# EAGLE design untitled (EAGLE 9.6.2)
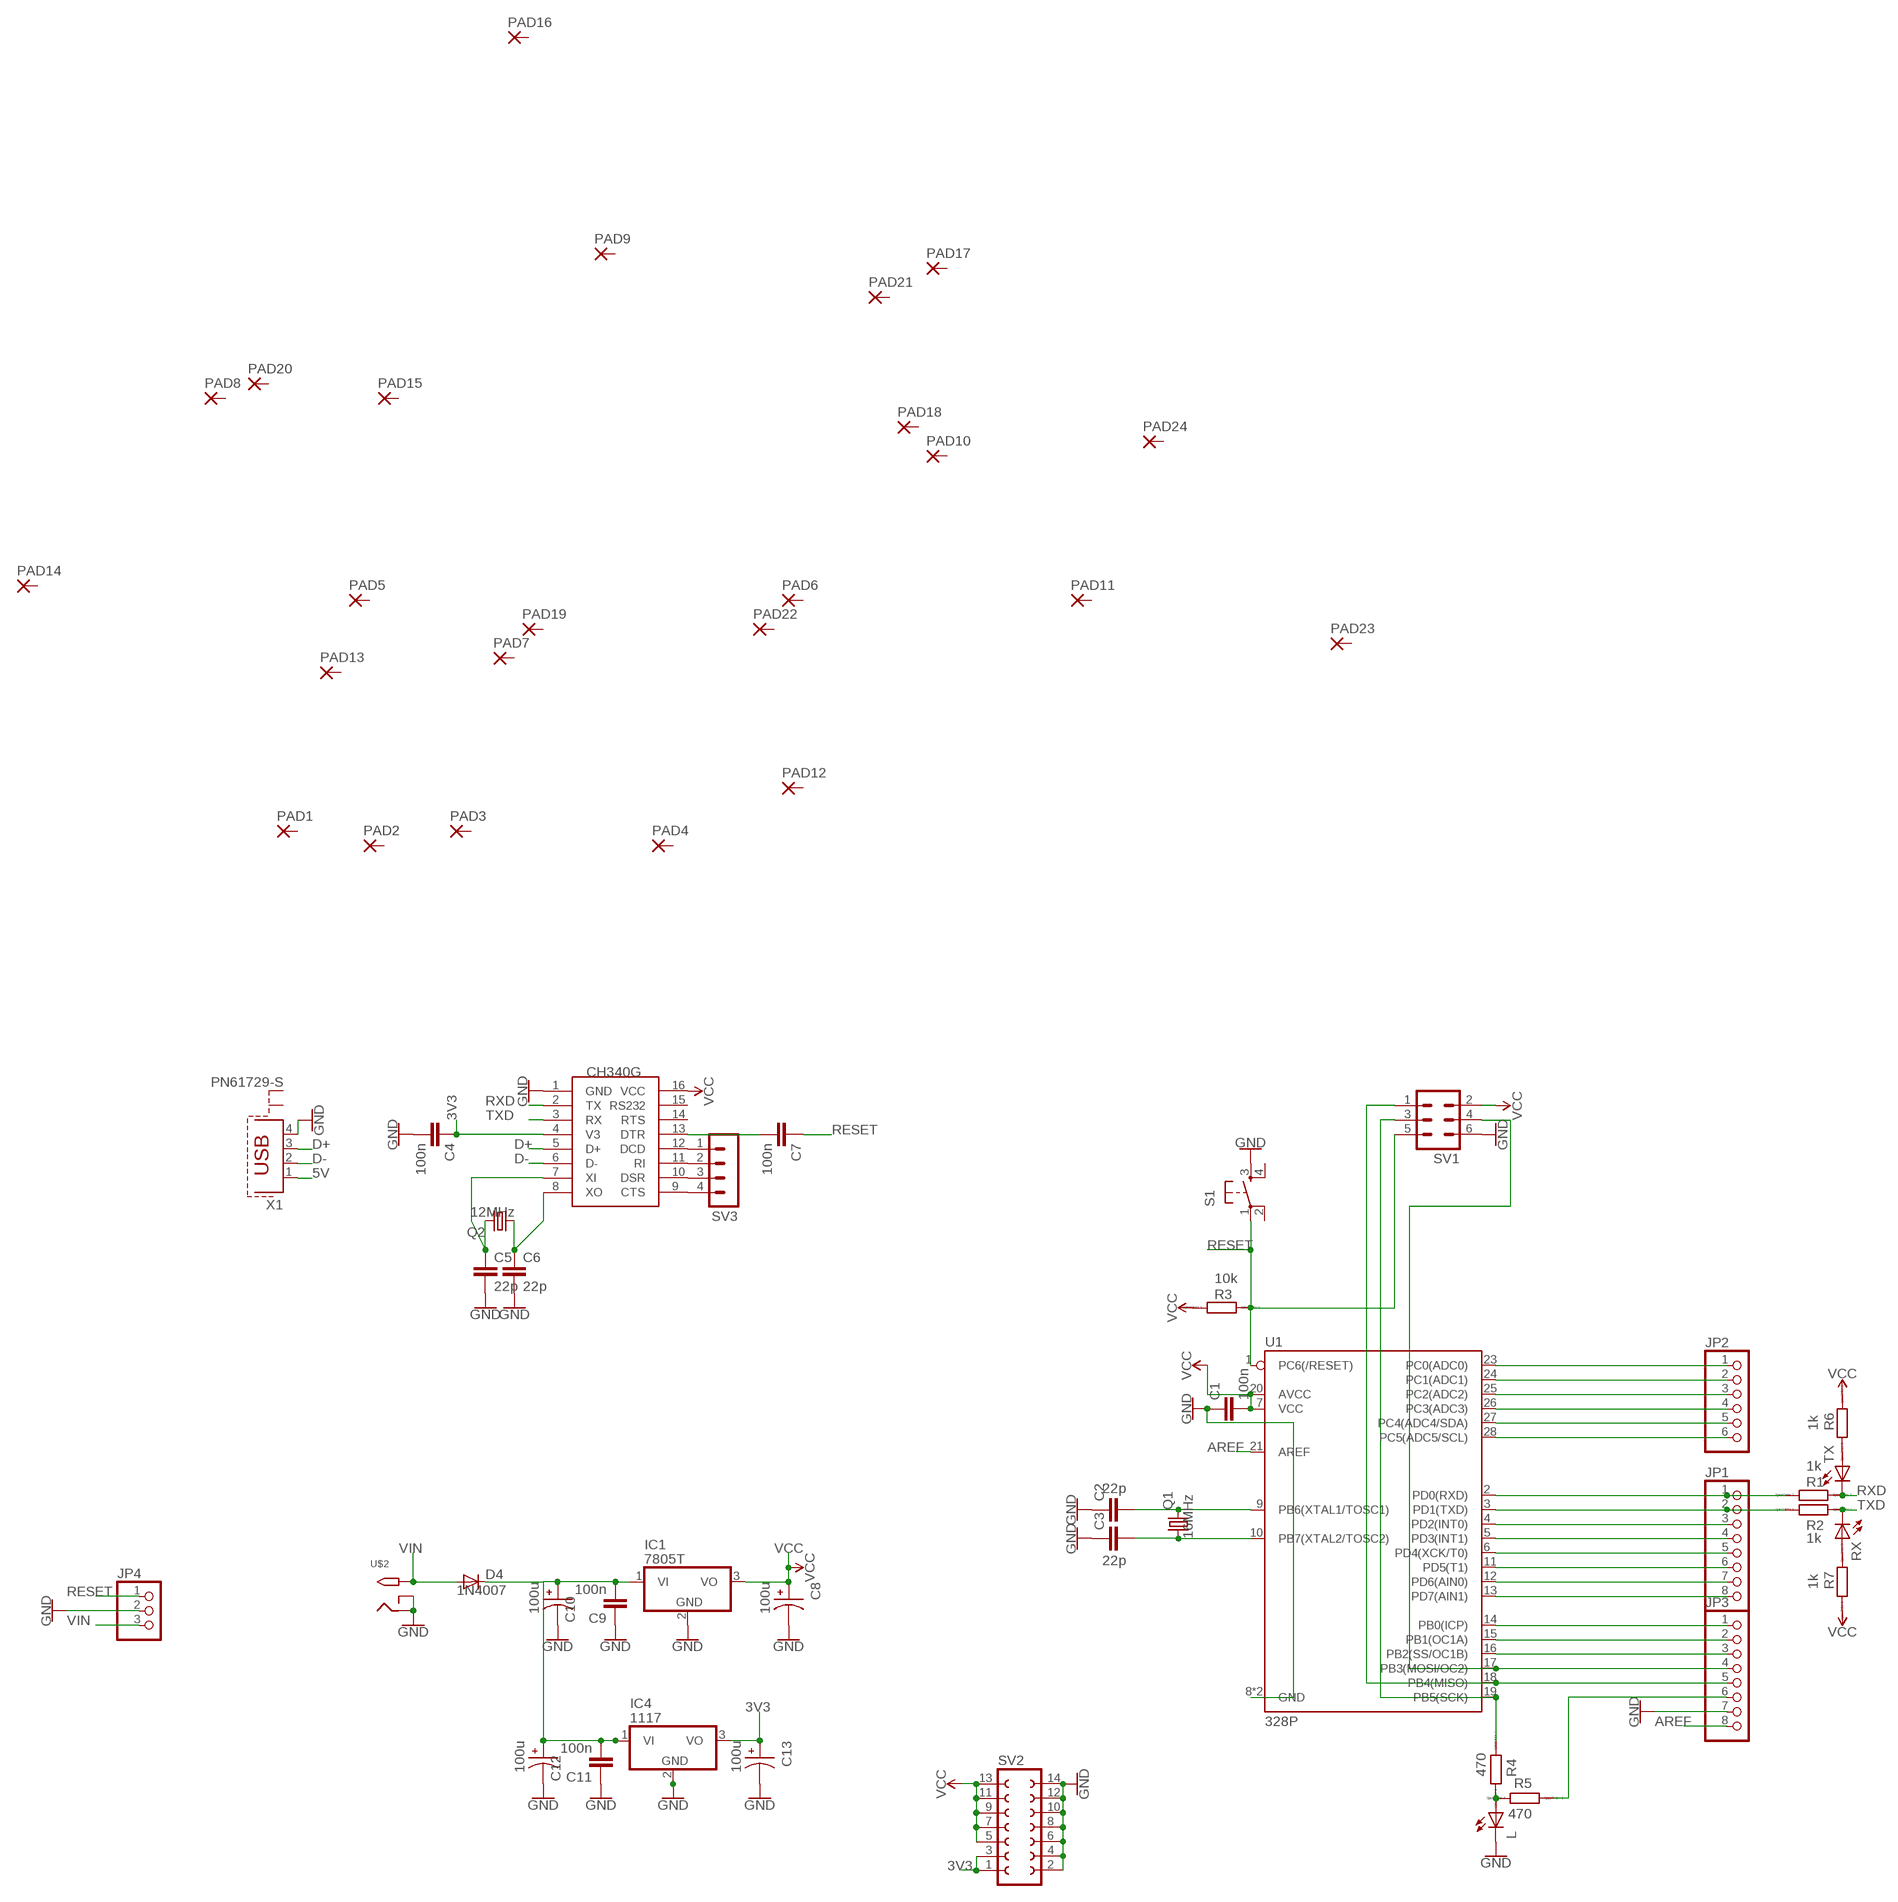
[diagram p0: schematic, sheet 1]

## Parts
C1  100n  C2,5-3  [C2.5-3]
C2  22p  C2,5-3  [C2.5-3]
C3  22p  C2,5-3  [C2.5-3]
C4  100n  C2,5-3  [C2.5-3]
C5  22p  C2,5-3  [C2.5-3]
C6  22p  C2,5-3  [C2.5-3]
C7  100n  C2,5-3  [C2.5-3]
C8  100u  ECA1VHG100B  [CAPPRD500W50D500H1100]
C9  100n  C2,5-3  [C2.5-3]
C10  100u  ECA1VHG100B  [CAPPRD500W50D500H1100]
C11  100n  C2,5-3  [C2.5-3]
C12  100u  ECA1VHG100B  [CAPPRD500W50D500H1100]
C13  100u  ECA1VHG100B  [CAPPRD500W50D500H1100]
D4  1N4007  1N4004  [DO41-10]
IC1  7805T  [TO220H]
IC4  1117  7805T  [TO220H]
JP1  PINHD-1X8CLEANBIG  [1X08-CLEANBIG]
JP2  PINHD-1X6  [1X06]
JP3  PINHD-1X8CLEANBIG  [1X08-CLEANBIG]
JP4  PINHD-1X3  [1X03]
L  LED3MM  [LED3MM]
PAD1  SMD5  [SMD2,54-5,08]
PAD2  SMD5  [SMD2,54-5,08]
PAD3  SMD5  [SMD2,54-5,08]
PAD4  SMD5  [SMD2,54-5,08]
PAD5  SMD5  [SMD2,54-5,08]
PAD6  SMD5  [SMD2,54-5,08]
PAD7  SMD5  [SMD2,54-5,08]
PAD8  SMD5  [SMD2,54-5,08]
PAD9  SMD5  [SMD2,54-5,08]
PAD10  SMD5  [SMD2,54-5,08]
PAD11  SMD5  [SMD2,54-5,08]
PAD12  SMD5  [SMD2,54-5,08]
PAD13  SMD5  [SMD2,54-5,08]
PAD14  SMD5  [SMD2,54-5,08]
PAD15  SMD5  [SMD2,54-5,08]
PAD16  SMD5  [SMD2,54-5,08]
PAD17  SMD5  [SMD2,54-5,08]
PAD18  SMD5  [SMD2,54-5,08]
PAD19  SMD5  [SMD2,54-5,08]
PAD20  SMD5  [SMD2,54-5,08]
PAD21  SMD5  [SMD2,54-5,08]
PAD22  SMD5  [SMD2,54-5,08]
PAD23  SMD5  [SMD2,54-5,08]
PAD24  SMD5  [SMD2,54-5,08]
Q1  16MHz  CRYSTALHC49S  [HC49/S]
Q2  12MHz  CRYSTALHC49S  [HC49/S]
R1  1k  R0204/7  [0204/7]
R2  1k  R0204/7  [0204/7]
R3  10k  R0204/7  [0204/7]
R4  470  R0204/7  [0204/7]
R5  470  R0204/7  [0204/7]
R6  1k  R0204/7  [0204/7]
R7  1k  R0204/7  [0204/7]
RX  LED3MM  [LED3MM]
S1  TAC_SWITCHPTH  [TACTILE-PTH]
SV1  MA03-2  [MA03-2]
SV2  FE07-2  [FE07-2]
SV3  MA04-1  [MA04-1]
TX  LED3MM  [LED3MM]
U1  328P  ATMEGA328P_PDIP  [DIP28]
U$1  CH340G  [SOIC16]
U$2  2.1MMJACKTHM  [PJ-102A]
X1  PN61729-S  [PN61729-S]

## Nets
3V3: C4.1 C13.P IC4.3(VO) SV2.1 SV2.3 U$1.4(V3)
5V: X1.1
AREF: JP3.8 U1.21(AREF)
D+: U$1.5(D+) X1.3
D-: U$1.6(D-) X1.2
GND: C1.1 C2.1 C3.1 C4.2 C5.2 C6.2 C8.N C9.1 C10.N C11.1 C12.N C13.N IC1.2(GND) IC4.2(GND) JP3.7 JP4.2 L.K(C) S1.3 SV1.6 SV2.2 SV2.4 SV2.6 SV2.8 SV2.10 SV2.12 SV2.14 U1.8(GND) U1.22(GND) U$1.1(GND) U$2.RING U$2.RING_SW X1.4
N$1: JP1.1 R1.1 U1.2(PD0(RXD))
N$2: JP1.2 R2.1 U1.3(PD1(TXD))
N$3: JP1.3 U1.4(PD2(INT0))
N$4: JP1.4 U1.5(PD3(INT1))
N$5: JP1.5 U1.6(PD4(XCK/T0))
N$6: JP1.6 U1.11(PD5(T1))
N$7: JP1.7 U1.12(PD6(AIN0))
N$8: JP1.8 U1.13(PD7(AIN1))
N$9: JP2.1 U1.23(PC0(ADC0))
N$10: JP2.2 U1.24(PC1(ADC1))
N$11: JP2.3 U1.25(PC2(ADC2))
N$12: JP2.4 U1.26(PC3(ADC3))
N$13: JP2.5 U1.27(PC4(ADC4/SDA))
N$14: JP2.6 U1.28(PC5(ADC5/SCL))
N$15: JP3.1 U1.14(PB0(ICP))
N$16: JP3.2 U1.15(PB1(OC1A))
N$17: JP3.3 U1.16(PB2(SS/OC1B))
N$18: JP3.4 SV1.4 U1.17(PB3(MOSI/OC2))
N$19: JP3.5 SV1.1 U1.18(PB4(MISO))
N$20: R4.2 SV1.3 U1.19(PB5(SCK))
N$21: C2.2 Q1.2 U1.9(PB6(XTAL1/TOSC1))
N$22: C3.2 Q1.1 U1.10(PB7(XTAL2/TOSC2))
N$23: SV3.1 U$1.12(DCD)
N$24: JP3.6 R5.1
N$25: C5.1 Q2.2 U$1.7(XI)
N$26: C6.1 Q2.1 U$1.8(XO)
N$27: L.A R4.1 R5.2
N$28: SV3.2 U$1.11(RI)
N$29: SV3.3 U$1.10(DSR)
N$30: SV3.4 U$1.9(CTS)
N$31: C7.2 U$1.13(DTR)
N$32: R6.1 TX.A
N$33: C9.2 C10.P C11.2 C12.P D4.C IC1.1(VI) IC4.1(VI)
N$34: R7.2 RX.A
RESET: C7.1 JP4.1 R3.2 S1.1 SV1.5 U1.1(PC6(/RESET))
RXD: R1.2 TX.K(C) U$1.2(TX)
TXD: R2.2 RX.K(C) U$1.3(RX)
VCC: C1.2 C8.P IC1.3(VO) R3.1 R6.2 R7.1 SV1.2 SV2.5 SV2.7 SV2.9 SV2.11 SV2.13 U1.7(VCC) U1.20(AVCC) U$1.16(VCC)
VIN: D4.A JP4.3 U$2.TIP
Unconnected: PAD1.1(P) PAD2.1(P) PAD3.1(P) PAD4.1(P) PAD5.1(P) PAD6.1(P) PAD7.1(P) PAD8.1(P) PAD9.1(P) PAD10.1(P) PAD11.1(P) PAD12.1(P) PAD13.1(P) PAD14.1(P) PAD15.1(P) PAD16.1(P) PAD17.1(P) PAD18.1(P) PAD19.1(P) PAD20.1(P) PAD21.1(P) PAD22.1(P) PAD23.1(P) PAD24.1(P) S1.2 S1.4 U$1.14(RTS) U$1.15(RS232) X1.S1 X1.S2

## Library data of the parts
C1-C7 C9 C11 = capacitor-wima:C: CAPACITOR naming: grid - package width
C8 C10 C12 C13 = ECA1VHG100B:ECA1VHG100B: NHG-A Check prices <https://pricing.snapeda.com/parts/ECA1VHG100B/Panasonic/view-part?ref=eda>; AVAILABILITY: In Stock; DESCRIPTION: Aluminum Electrolytic Capacitors; MF: Panasonic; MP: ECA1VHG100B; PACKAGE: RADIAL-2 Panasonic; PRICE: None
D4 = adafruit:1N4004: DIODE General purpose 1N400x type rectifier (With bigger pads) http://www.ladyada.net/library/pcb/eaglelibrary.html
IC1 IC4 = linear:78*: Positive VOLTAGE REGULATOR Source: http://cache.national.com/ds/LM/LM78L05.pdf http://www.fairchildsemi.com/ds/LM/LM7805.pdf
JP1 JP3 = adafruit:PINHD-1X8: PIN HEADER
JP2 = adafruit:PINHD-1X6: PIN HEADER
JP4 = adafruit:PINHD-1X3: PIN HEADER
L RX TX = adafruit:LED: LED OSRAM: - CHIPLED LG R971, LG N971, LY N971, LG Q971, LY Q971, LO R971, LY R971 LH N974, LH R974 LS Q976, LO Q976, LY Q976 LO Q996 - Hyper CHIPLED LW Q18S LB Q993, LB Q99A, LB R99A - SideLED LS A670, LO A670, LY A670, LG A670, LP A670 LB A673, LV A673, LT A673, LW A673 LH A674 LY A675 LS A676, LA A676, LO A676, LY A676, LW A676 LS A679, LY A679, LG A679 - Hyper Micro SIDELED® LS Y876, LA Y876, LO Y876, LY Y876 LT Y87S - SmartLED LW L88C, LW L88S LB L89C, LB L89S, LG L890 LS L89K, LO L89K, LY L89K LS L896, LA L896, LO L896, LY L896 - TOPLED LS T670, LO T670, LY T670, LG T670, LP T670 LSG T670, LSP T670, LSY T670, LOP T670, LYG T670 LG T671, LOG T671, LSG T671 LB T673, LV T673, LT T673, LW T673 LH T674 LS T676, LA T676, LO T676, LY T676, LB T676, LH T676, LSB T676, LW T676 LB T67C, LV T67C, LT T67C, LS T67K, LO T67K, LY T67K, LW E67C LS E67B, LA E67B, LO E67B, LY E67B, LB E67C, LV E67C, LT E67C LW T67C LS T679, LY T679, LG T679 LS T770, LO T770, LY T770, LG T770, LP T770 LB T773, LV T773, LT T773, LW T773 LH T774 LS E675, LA E675, LY E675, LS T675 LS T776, LA T776, LO T776, LY T776, LB T776 LHGB T686 LT T68C, LB T68C - Hyper Mini TOPLED® LB M676 - Mini TOPLED Santana® LG M470 LS M47K, LO M47K, LY M47K Source: http://www.osram.convergy.de/
PAD1-PAD24 = wirepad:SMD5: SMD PAD
Q1 Q2 = crystal:CRYSTAL: CRYSTAL; OC_FARNELL: 1667008; OC_NEWARK: unknown
R1-R7 = eagle-ltspice:R: RESISTOR, European symbol; SPICEMODEL: NONE; SPICEPREFIX: R
S1 = SparkFun-Retired:TAC_SWITCH: Momentary Switch Button commonly used for reset or general input. Spark Fun Electronics SKU : COM-00097 SMT- SWCH-08247
SV1 = con-lstb:MA03-2: PIN HEADER; OC_FARNELL: unknown; OC_NEWARK: unknown
SV2 = con-lsta:FE07-2: FEMALE HEADER; OC_FARNELL: unknown; OC_NEWARK: unknown
SV3 = con-lstb:MA04-1: PIN HEADER; OC_FARNELL: unknown; OC_NEWARK: unknown
U1 = SparkFun-IC-Microcontroller:ATMEGA328P_PDIP: Atmel 328P Through hole ATMEGA328P uC used in the Arduino 32kb flash, 1k EEPROM, 2k SRAM Datasheet <http://www.sparkfun.com/datasheets/Components/SMD/ATMega328.pdf> SparkFun Products Storefront component: AVR 28 Pin 20MHz 32K 6A/D - ATMega328P <https://www.sparkfun.com/products/9061> (COM-09061) SparkFun Simon Says - Through-Hole Soldering Kit <https://www.sparkfun.com/products/10547> (KIT-10547) SparkFun Learn to Solder - Simon Says <https://www.sparkfun.com/products/13708> (KIT-13708) SparkFun BigTime Watch Kit <https://www.sparkfun.com/products/11734> (KIT-11734) SparkFun ClockIt <https://www.sparkfun.com/products/10930> (KIT-10930) SparkFun Serial Enabled LCD Kit <https://www.sparkfun.com/products/10097> (LCD-10097) SparkFun Simon Tilts - Through Hole Soldering Kit <https://www.sparkfun.com/products/12634> (KIT-12634) SparkFun Frequency Counter Kit <https://www.sparkfun.com/products/10140> (KIT-10140) FabFM Radio Kit <https://www.sparkfun.com/products/11043> (KIT-11043) SparkFun Binary Blaster Kit <https://www.sparkfun.com/products/12037> (KIT-12037) SparkFun Metro-Gnome <https://www.sparkfun.com/products/9236> (KIT-09236) ATmega328 with Arduino Optiboot (Uno) <https://www.sparkfun.com/products/10524> (DEV-10524); PROD_ID: IC-09136
U$1 = ch340g:CH340G
U$2 = adafruit:2.1MMJACK: 2.1mm x 5.5mm THM DC jack with internal switch. Digikey part #PJ-102A, 4UCON part #05537 2.1mm x 5.5mm SMT DC jack with internal switch. Digikey part #PJ-002A-SMT, 4UCON part #03267 By microbuilder.eu & adafruit.com
X1 = con-berg:PN61729-S: BERG USB connector; OC_FARNELL: unknown; OC_NEWARK: unknown

## Board
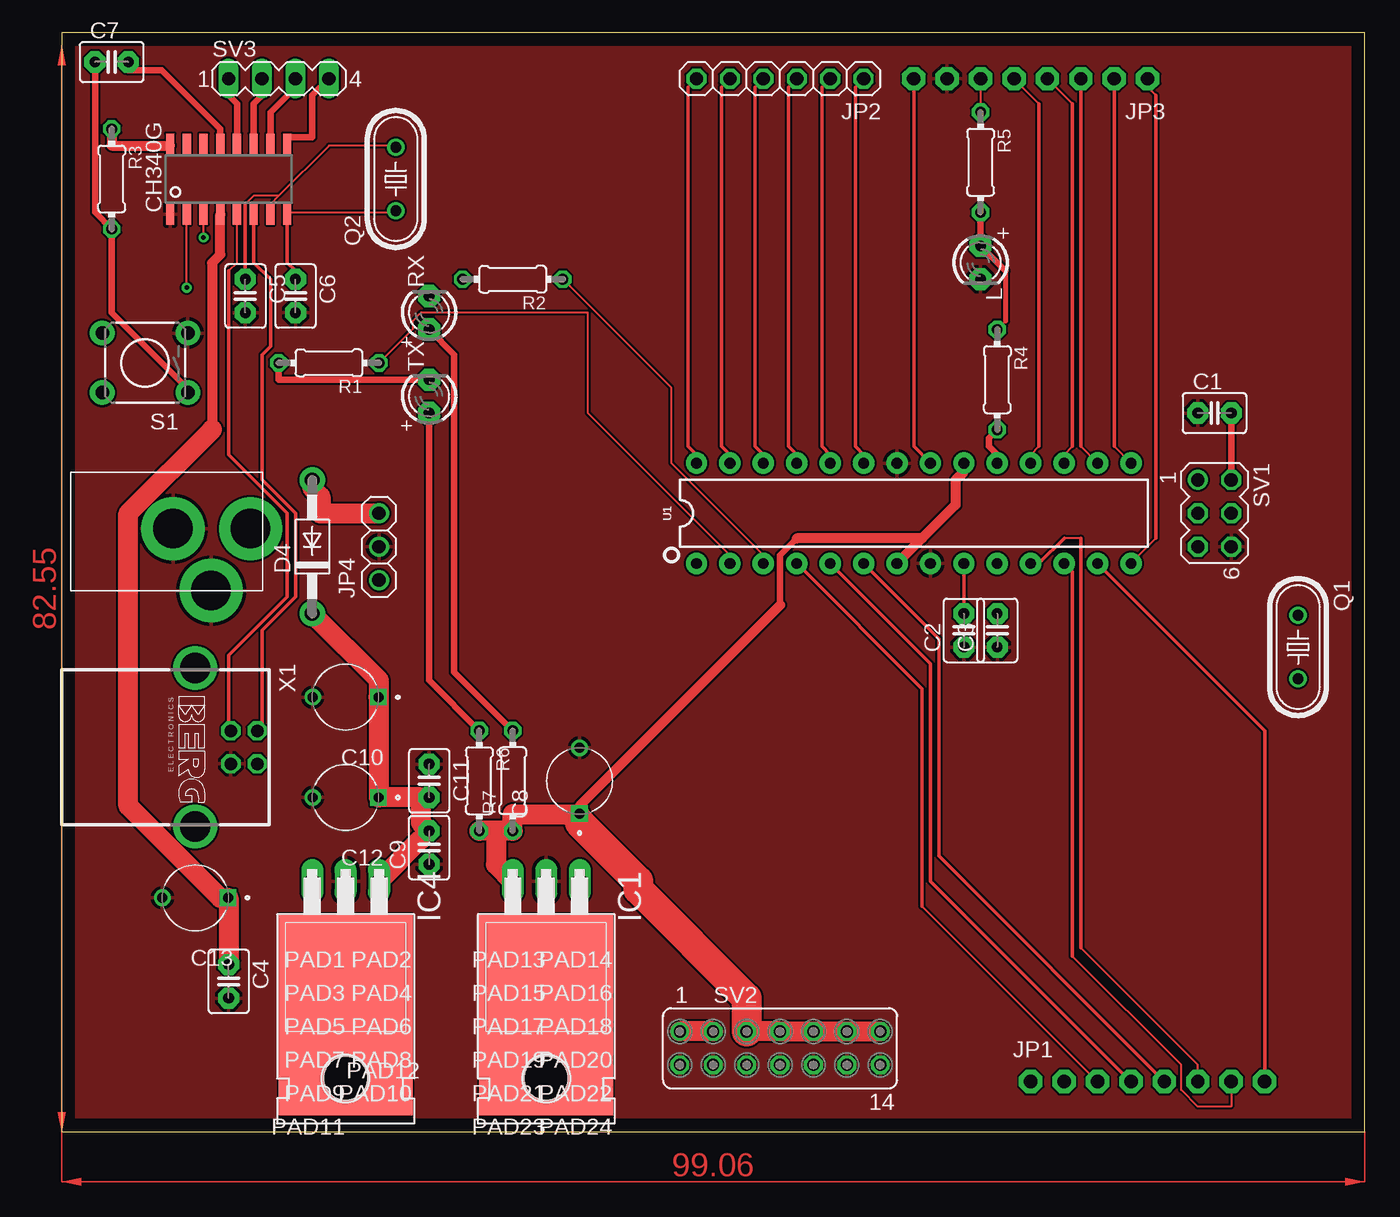
[diagram p1: board, top side]
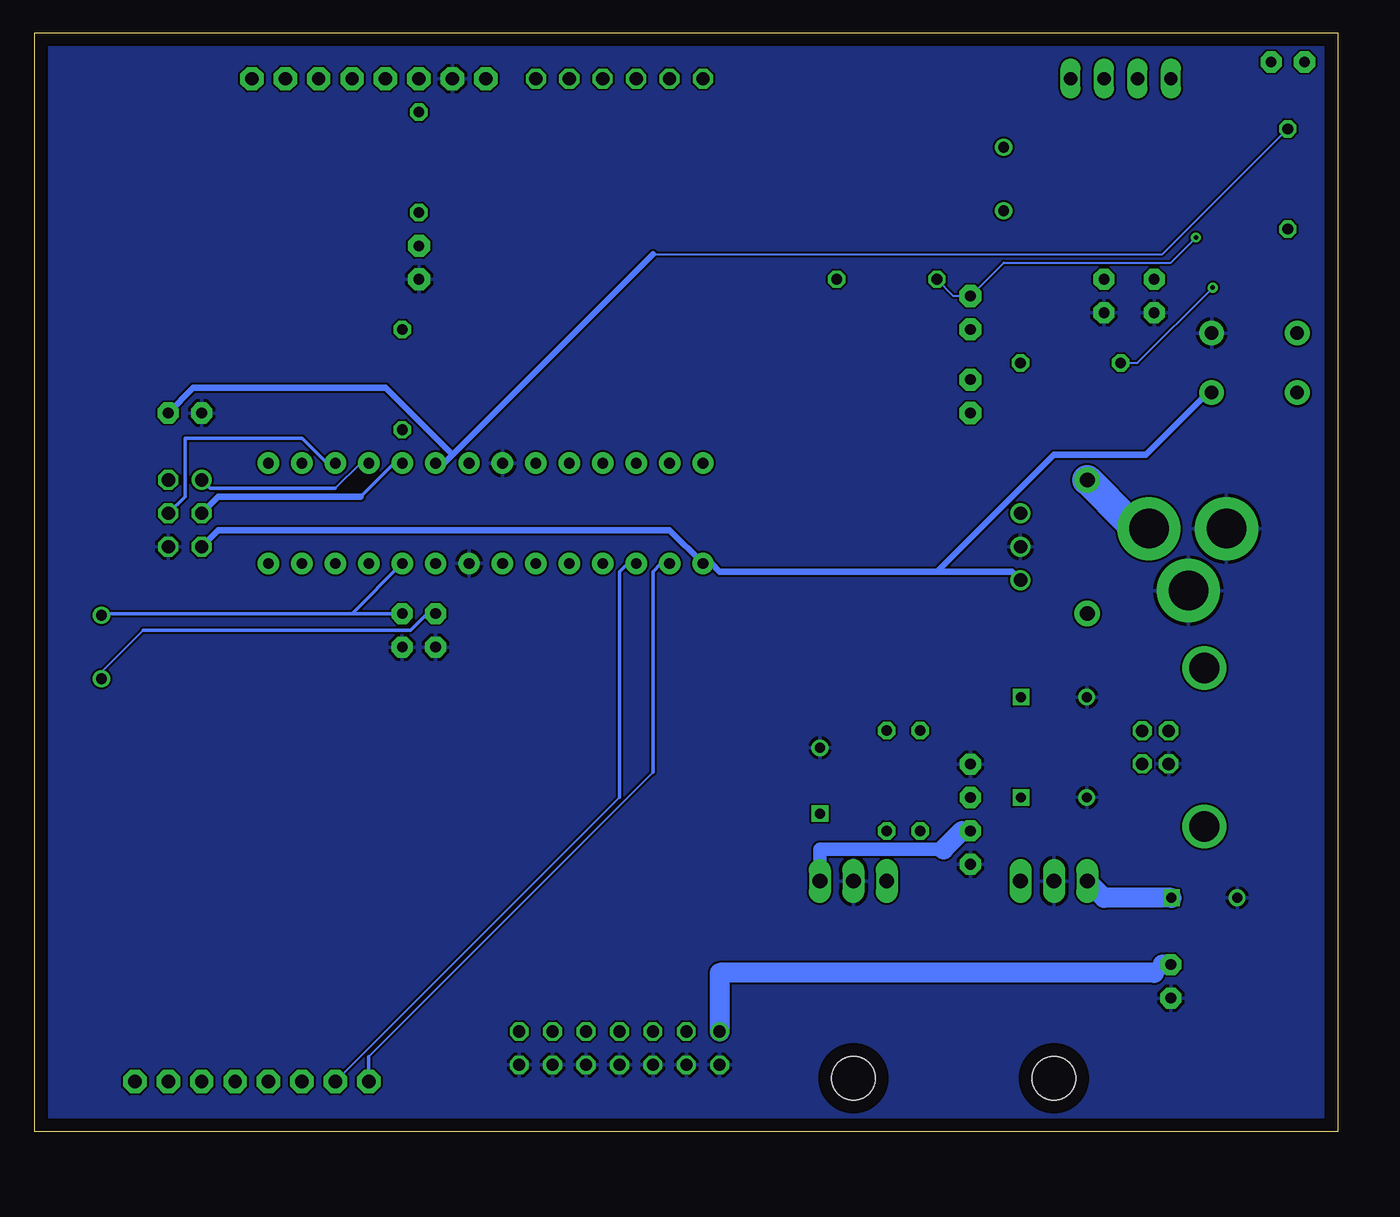
[diagram p2: board, bottom side, seen from below]

Size 99.04 x 83.49 mm. Coordinates in mm from the lower left corner, seen from the top.
Outline: 0,0 99.04,0 99.04,83.49 0,83.49 0,0
Copper layers (1*16): Top 0.035mm / dielectric 1.5mm / Bottom 0.035mm
Design rules "default": minimum track width 6mil, minimum drill 0.35mm, track to track 6mil, track to pad 6mil, pad to pad 6mil, via to via 6mil, smd to smd 6mil, copper to edge 40mil, drill to drill 6mil, minimum pad ring 10mil, minimum via ring 8mil, stop-mask expansion 4mil, vias tented up to drill 0mil, thermal gap 10mil

### Footprints (pad centres in the part's own frame; a part is rotated, then mirrored left to right if it is on the bottom)
C2.5-3 = drill 0.813 pad 1.6 octagon: 1 -1.27,0; 2 1.27,0
CAPPRD500W50D500H1100 = drill 0.75 pad 1.1: N 2.5,0 | drill 0.75 pad 1.1 square: P -2.5,0
DO41-10 = drill 1.118 pad 1.93: A 5.08,0; C -5.08,0
TO220H = drill 1.118 long: 1 -2.54,-10.16; 2 0,-10.16; 3 2.54,-10.16 | hole 3.302: 0,4.826
1X08-CLEANBIG = drill 1.016 pad 1.778 octagon: 1 -8.89,0; 2 -6.35,0; 3 -3.81,0; 4 -1.27,0; 5 1.27,0; 6 3.81,0; 7 6.35,0; 8 8.89,0
1X06 = drill 1.016 octagon: 1 -6.35,0; 2 -3.81,0; 3 -1.27,0; 4 1.27,0; 5 3.81,0; 6 6.35,0
1X03 = drill 1.016: 1 -2.54,0; 2 0,0; 3 2.54,0
LED3MM = drill 0.813 pad 1.676 octagon: A -1.27,0; K 1.27,0
SMD2,54-5,08 = smd 2.54 x 5.08: 1 0,0
HC49/S = drill 0.813: 1 -2.413,0; 2 2.413,0
0204/7 = drill 0.813 octagon: 1 -3.81,0; 2 3.81,0
TACTILE-PTH = drill 1.016 pad 1.88: 1 -3.251,2.261; 2 3.251,2.261; 3 -3.251,-2.261; 4 3.251,-2.261
MA03-2 = drill 1.016: 1 -2.54,-1.27 | drill 1.016 octagon: 2 -2.54,1.27; 3 0,-1.27; 4 0,1.27; 5 2.54,-1.27; 6 2.54,1.27
FE07-2 = drill 0.914: 1 -7.62,1.27 | drill 0.914 octagon: 2 -7.62,-1.27; 3 -5.08,1.27; 4 -5.08,-1.27; 5 -2.54,1.27; 6 -2.54,-1.27; 7 0,1.27; 8 0,-1.27; 9 2.54,1.27; 10 2.54,-1.27; 11 5.08,1.27; 12 5.08,-1.27; 13 7.62,1.27; 14 7.62,-1.27
MA04-1 = drill 1.016 long: 1 -3.81,0; 2 -1.27,0; 3 1.27,0; 4 3.81,0
DIP28 = drill 0.813 pad 1.626: 1 -16.51,-3.81; 2 -13.97,-3.81; 3 -11.43,-3.81; 4 -8.89,-3.81; 5 -6.35,-3.81; 6 -3.81,-3.81; 7 -1.27,-3.81; 8 1.27,-3.81; 9 3.81,-3.81; 10 6.35,-3.81; 11 8.89,-3.81; 12 11.43,-3.81; 13 13.97,-3.81; 14 16.51,-3.81; 15 16.51,3.81; 16 13.97,3.81; 17 11.43,3.81; 18 8.89,3.81; 19 6.35,3.81; 20 3.81,3.81; 21 1.27,3.81; 22 -1.27,3.81; 23 -3.81,3.81; 24 -6.35,3.81; 25 -8.89,3.81; 26 -11.43,3.81; 27 -13.97,3.81; 28 -16.51,3.81
SOIC16 = smd 0.635 x 1.524: 1 -4.445,-2.695; 2 -3.175,-2.695; 3 -1.905,-2.695; 4 -0.635,-2.695; 5 0.635,-2.695; 6 1.905,-2.695; 7 3.175,-2.695; 8 4.445,-2.695; 9 4.445,2.695; 10 3.175,2.695; 11 1.905,2.695; 12 0.635,2.695; 13 -0.635,2.695; 14 -1.905,2.695; 15 -3.175,2.695; 16 -4.445,2.695
PJ-102A = drill 3 pad 4.8: RING 0.1,-3.39; RING_SW -4.6,-6.29; TIP 0.1,-9.29
PN61729-S = drill 0.95 octagon: 1 1.25,4.71; 2 -1.25,4.71; 3 -1.25,2.71; 4 1.25,2.71 | drill 2.3 pad 2.9: S1 -6.02,0; S2 6.02,0

### Placement (x,y rotation side)
C1  87.63,54.61 0 top
C2  68.58,38.1 90 top
C3  71.12,38.1 90 top
C4  12.7,11.43 270 top
C5  13.97,63.5 270 top
C6  17.78,63.5 270 top
C7  3.81,81.28 0 top
C8  39.37,26.67 90 top
C9  27.94,21.59 90 top
C10  21.59,33.02 180 top
C11  27.94,26.67 270 top
C12  21.59,25.4 180 top
C13  10.16,17.78 180 top
D4  19.05,44.45 90 top
IC1  36.83,8.89 180 top
IC4  21.59,8.89 180 top
JP1  82.55,3.81 0 top
JP2  54.61,80.01 180 top
JP3  73.66,80.01 180 top
JP4  24.13,44.45 90 top
L  69.85,66.04 270 top
PAD1  19.05,15.24 90 top
PAD2  24.13,15.24 90 top
PAD3  19.05,12.7 90 top
PAD4  24.13,12.7 90 top
PAD5  19.05,10.16 90 top
PAD6  24.13,10.16 90 top
PAD7  19.05,7.62 90 top
PAD8  24.13,7.62 90 top
PAD9  19.05,5.08 90 top
PAD10  24.13,5.08 90 top
PAD11  19.05,2.54 90 top
PAD12  24.13,2.54 270 top
PAD13  34.29,15.24 90 top
PAD14  39.37,15.24 90 top
PAD15  34.29,12.7 90 top
PAD16  39.37,12.7 90 top
PAD17  34.29,10.16 90 top
PAD18  39.37,10.16 90 top
PAD19  34.29,7.62 90 top
PAD20  39.37,7.62 90 top
PAD21  34.29,5.08 90 top
PAD22  39.37,5.08 90 top
PAD23  34.29,2.54 90 top
PAD24  39.37,2.54 90 top
Q1  93.98,36.83 270 top
Q2  25.4,72.39 90 top
R1  20.32,58.42 180 top
R2  34.29,64.77 180 top
R3  3.81,72.39 270 top
R4  71.12,57.15 270 top
R5  69.85,73.66 270 top
R6  31.75,26.67 270 top
R7  34.29,26.67 90 top
RX  27.94,62.23 90 top
S1  6.35,58.42 180 top
SV1  87.63,46.99 270 top
SV2  54.61,6.35 0 top
SV3  16.51,80.01 0 top
TX  27.94,55.88 90 top
U1  64.77,46.99 0 top
U$1  12.7,72.39 0 top
U$2  5.08,45.72 90 top
X1  10.16,29.21 270 top

### Tracks (layer width: path | path; a pad name or v marks a point on that pad's centre or on a via)
3V3
  Top 0.152: 12.06,17.78 C13.P 12.7,17.78
  Top 0.762: U$1.4 12.06,66.65 11.43,66.01 11.43,53.34
  Top 1.524: SV2.3 SV2.1 | 11.43,53.34 5.08,46.99 5.08,24.77 12.06,17.78 | 12.7,17.78 C4.1
  Bottom 0.152: 13.34,12.7 13.97,12.06
  Bottom 1.524: IC4.3 17.78,17.78 C13.P | SV2.1 46.99,12.06 13.97,12.06 | C4.1 13.34,12.7
AREF
  Top 0.254: U1.21 64.77,52.07 JP3.8
D+
  Top 0.152: U$1.5 13.34,66.04 12.7,65.41 | 12.7,30.48 X1.3
  Top 0.254: 12.7,65.41 12.7,51.44 17.14,46.99 17.14,40.64 12.7,36.2 12.7,30.48
D-
  Top 0.152: 15.24,30.48 X1.2
  Top 0.254: U$1.6 14.61,66.04 15.88,64.77 15.88,59.69 15.24,59.05 15.24,49.53 17.78,46.99 17.78,40.64 15.24,38.1 15.24,30.48
GND
  pour Top: 0,83.82 0,0 99.06,0 99.06,83.82
  pour Bottom: 0,83.82 0,0 99.06,0 99.06,85.09
N$1
  Top 0.152: R1.1 26.67,60.96 26.67,61.59 27.3,62.23 40.01,62.23 40.01,54.61 50.8,43.81 U1.2
  Bottom 0.152: 52.07,27.3 73.66,5.71 | U1.2 51.44,43.18
  Bottom 0.254: 73.66,5.71 JP1.1 | 52.07,27.3 52.07,42.55 51.44,43.18
N$2
  Top 0.152: R2.1 46.35,56.52 46.35,50.8 53.34,43.81 U1.3
  Bottom 0.152: 54.61,25.4 JP1.2 | U1.3 53.98,43.18
  Bottom 0.254: 54.61,25.4 54.61,42.55 53.98,43.18
N$3
  Top 0.152: JP1.3 65.41,17.14
  Top 0.254: U1.4 65.41,33.66 65.41,17.14
N$4
  Top 0.254: U1.5 66.04,35.56 66.04,19.05 JP1.4
N$5
  Top 0.254: U1.6 66.67,37.47 66.67,20.95 JP1.5
N$6
  Top 0.152: 74.3,43.18 U1.11 | 77.47,45.09 76.2,45.09 | 77.47,13.97 86.36,5.08 JP1.6
  Top 0.254: 76.2,45.09 74.3,43.18 | 77.47,13.97 77.47,45.09
N$7
  Top 0.152: 76.83,42.55 U1.12 | 76.83,13.34 85.09,5.08 85.09,3.17 86.36,1.91 88.9,1.91 JP1.7
  Top 0.254: 76.83,13.34 76.83,42.55
N$8
  Top 0.254: U1.13 91.44,30.48 JP1.8
N$9
  Top 0.152: 60.33,79.38 JP2.1 | U1.23 60.96,51.44
  Top 0.254: 60.33,79.38 60.33,52.07 60.96,51.44
N$10
  Top 0.152: 57.78,79.38 JP2.2 | U1.24 58.42,51.44
  Top 0.254: 57.78,79.38 57.78,52.07 58.42,51.44
N$11
  Top 0.152: 55.24,79.38 JP2.3 | U1.25 55.88,51.44
  Top 0.254: 55.24,79.38 55.24,52.07 55.88,51.44
N$12
  Top 0.152: 52.7,79.38 JP2.4 | U1.26 53.34,51.44
  Top 0.254: 52.7,79.38 52.7,52.07 53.34,51.44
N$13
  Top 0.152: 50.16,79.38 JP2.5 | U1.27 50.8,51.44
  Top 0.254: 50.16,79.38 50.16,52.07 50.8,51.44
N$14
  Top 0.152: 47.62,79.38 JP2.6 | U1.28 48.26,51.44
  Top 0.254: 47.62,79.38 47.62,52.07 48.26,51.44
N$15
  Top 0.152: 83.19,45.09 U1.14 | 83.19,78.74 82.55,79.38 JP3.1
  Top 0.254: 83.19,78.74 83.19,45.09
N$16
  Top 0.152: 80.01,52.07 U1.15
  Top 0.254: JP3.2 80.01,52.07
N$17
  Top 0.152: 77.47,52.07 U1.16
  Top 0.254: JP3.3 77.47,52.07
N$18
  Top 0.152: 76.83,78.11 JP3.4 | 76.83,52.07 76.2,51.44 U1.17
  Top 0.254: 76.83,52.07 76.83,78.11
  Bottom 0.152: U1.17 76.83,50.8
  Bottom 0.254: SV1.4 87.63,48.26 87.63,52.7 78.74,52.7 76.83,50.8
N$19
  Top 0.152: 74.3,78.11 JP3.5 | 74.3,52.07 73.66,51.44 U1.18
  Top 0.254: 74.3,52.07 74.3,78.11
  Bottom 0.152: 76.2,48.9 74.3,50.8 U1.18
  Bottom 0.254: SV1.1 85.72,48.9 76.2,48.9
N$20
  Top 0.152: U1.19 71.12,51.44
  Top 0.508: R4.2 70.48,52.7 70.48,52.07 71.12,51.44
  Bottom 0.152: U1.19 71.75,50.8
  Bottom 0.254: 71.75,50.8 74.3,48.26
  Bottom 0.508: SV1.3 85.09,48.26 74.3,48.26
N$21
  Top 0.254: C2.2 U1.9
  Bottom 0.152: 90.81,38.1 93.98,34.92 Q1.2 | C2.2 69.22,39.37
  Bottom 0.254: 90.81,38.1 70.48,38.1 69.22,39.37
N$22
  Bottom 0.152: 93.98,39.37 Q1.1
  Bottom 0.254: C3.2 74.93,39.37 | 74.93,39.37 93.98,39.37 | 74.93,39.37 U1.10
N$23
  Top 0.508: U$1.12 13.34,78.11 12.7,78.74 SV3.1
N$24
  Top 0.152: JP3.6 R5.1
N$25
  Top 0.152: U$1.7 15.88,70.48 16.51,71.12 | 16.51,71.12 20.32,74.93 25.4,74.93 Q2.2 | 13.97,70.48 14.61,71.12 16.51,71.12
  Top 0.254: 13.97,70.48 C5.1
N$26
  Top 0.152: C6.1 17.78,65.41 | Q2.1 25.4,69.85 17.14,69.85 U$1.8
  Top 0.254: U$1.8 17.14,66.04 17.78,65.41
N$27
  Top 0.152: 71.75,61.59 R4.1
  Top 0.381: 71.75,65.41 71.75,61.59
  Top 0.508: R5.2 L.A 71.75,65.41
N$28
  Top 0.508: U$1.11 14.61,78.11 15.24,78.74 SV3.2
N$29
  Top 0.508: U$1.10 15.88,77.47 17.78,79.38 SV3.3
N$30
  Top 0.152: 17.14,75.56 U$1.9
  Top 0.508: 17.14,75.56 19.05,75.56 19.05,78.74 SV3.4
N$31
  Top 0.152: C7.2 5.08,80.64
  Top 0.508: U$1.13 12.06,76.2 7.62,80.64 5.08,80.64
N$32
  Top 0.508: R6.1 27.94,34.29 TX.A
N$33
  Top 0.152: 24.13,25.4 C12.P | 27.3,25.4 C11.2 | 27.3,23.5 27.3,22.23
  Top 1.524: 24.13,33.02 24.13,25.4 27.3,25.4 27.3,23.5 C9.2 | 27.3,22.23 IC4.1 | D4.C 24.13,34.29 24.13,33.02 | 24.13,33.02 C10.P
  Bottom 0.152: C9.2 28.57,22.86
  Bottom 1.016: IC1.1 39.37,21.46 29.97,21.46
  Bottom 1.524: 28.57,22.86 29.97,21.46
N$34
  Top 0.508: R7.2 29.84,34.92 29.84,59.05 RX.A
RESET
  Top 0.152: 9.53,56.52 S1.1
  Top 0.508: C7.1 2.54,69.85 R3.2 3.81,62.23 9.53,56.52
  Bottom 0.152: 10.16,55.88 S1.1
  Bottom 0.508: JP4.1 24.77,42.55 30.48,42.55 | 30.48,42.55 46.99,42.55 47.62,43.18 U1.1 50.8,45.72 85.09,45.72 SV1.5 | 10.16,55.88 14.61,51.44 21.59,51.44 30.48,42.55
RXD  (via drill 0.35)
  Top 0.152: v9.53,64.14 U$1.2
  Top 0.508: TX.K 16.51,57.15 R1.2
  Bottom 0.152: v9.53,64.14 15.24,58.42 R1.2
TXD  (via drill 0.35)
  Top 0.152: v10.79,67.94 U$1.3
  Bottom 0.152: v10.79,67.94 12.7,66.04 25.4,66.04 RX.K 29.21,63.5 R2.2
VCC
  Top 0.152: 39.37,23.5 39.37,24.13 C8.P 39.37,24.77 | 8.26,74.93 U$1.16
  Top 0.508: C1.2 SV1.2 | 54.61,40.01 54.61,43.81 55.88,45.09
  Top 0.762: 8.26,74.93 3.81,74.93 R3.1 | 65.41,45.09 67.94,47.62 67.94,49.53 68.58,50.16 U1.20 | 65.41,45.09 U1.7 | 54.61,40.01 39.37,24.77 | 65.41,45.09 55.88,45.09
  Top 1.524: SV2.5 SV2.7 SV2.9 SV2.11 SV2.13 | 39.37,24.13 34.29,24.13 R7.1 33.02,22.86 | 33.02,22.86 R6.2 | IC1.3 33.02,20.32 33.02,22.86
  Top 2.286: SV2.5 52.07,10.16 43.81,18.41 43.81,19.05 39.37,23.5
  Bottom 0.152: R3.1 13.34,66.67 52.07,66.67 | U1.20 67.94,50.8
  Bottom 0.508: 67.94,50.8 67.31,51.44 | 67.31,51.44 52.07,66.67 | C1.2 87,56.52 72.39,56.52 67.31,51.44
VIN
  Top 0.152: D4.A 19.05,48.9
  Top 1.524: JP4.3 19.68,46.99 19.68,48.26 19.05,48.9
  Bottom 0.152: 14.61,46.35 15.88,46.35
  Bottom 2.286: 15.88,46.35 D4.A | 14.61,46.35 U$2.TIP
(copper drawn outside any net)
  shapes: Top area x2